# EAGLE design nanoCUL_v3.4 (EAGLE 6.6.0)

## Sheet 1 of 3
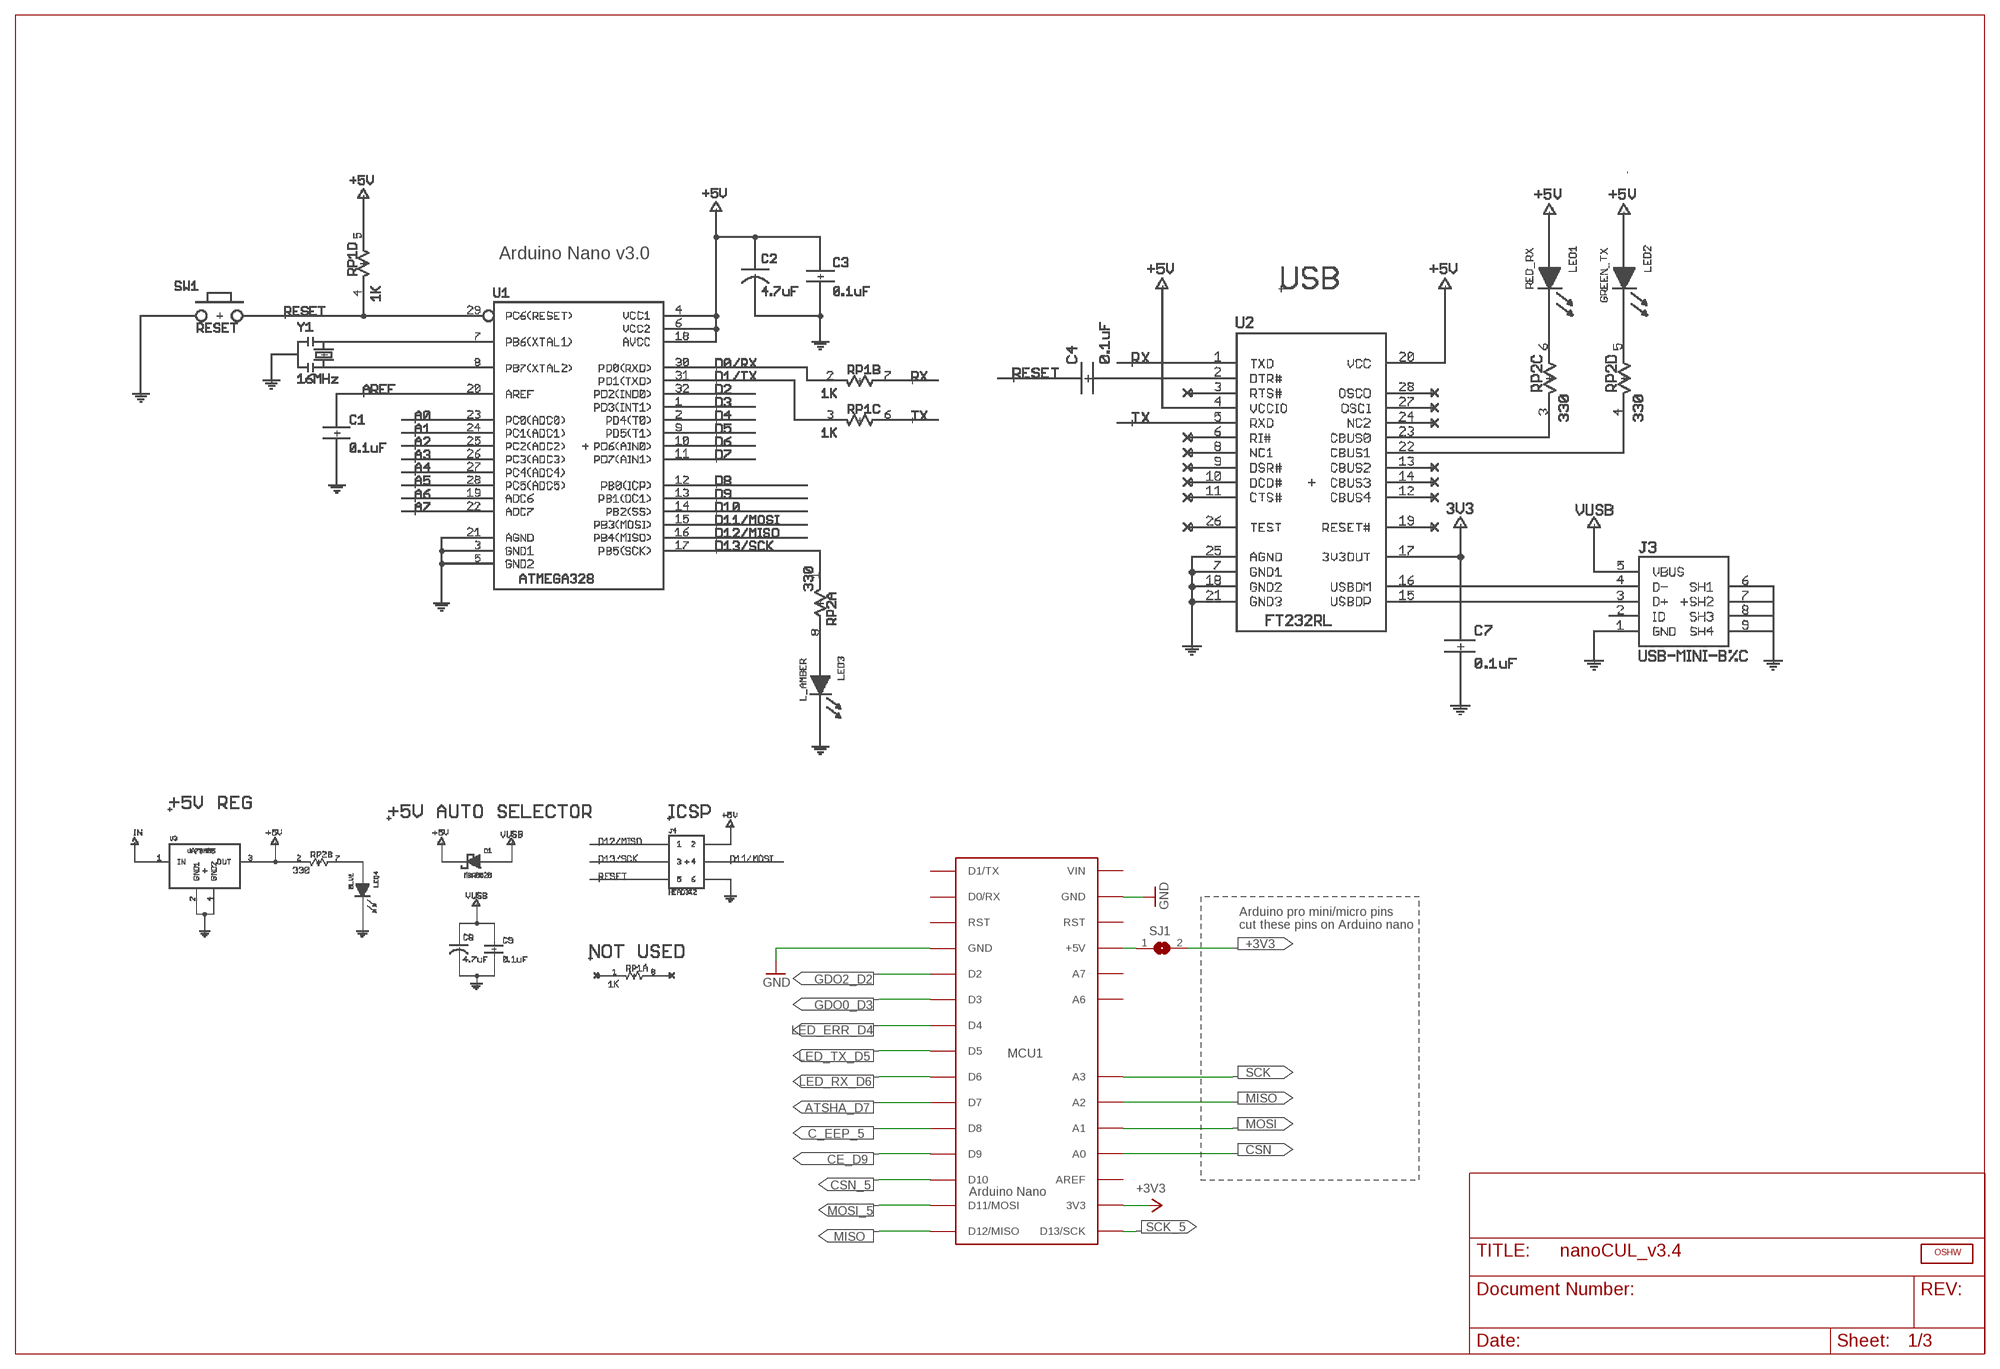
[diagram p0: schematic, sheet 1]

### Parts
LOGO1  LOGO_OSHWX0070  [OSHW_6X70]
MCU1  ARDUINO_NANO_NO_A4-A5  [ARDUINO_NANO_NO_A4-A5]
SJ1  SJ  [SJ]

### Nets
+3V3: MCU1.3V3 SJ1.2 ; also sheet 2,3
+5V: MCU1.+5V SJ1.1
ATSHA_D7: MCU1.D7 ; also sheet 2,3
C_EEP_5: MCU1.D8 ; also sheet 2,3
CE_D9: MCU1.D9 ; also sheet 2,3
CSN: MCU1.A0 ; also sheet 2,3
CSN_5: MCU1.D10 ; also sheet 3
GDO0_D3: MCU1.D3 ; also sheet 2,3
GDO2_D2: MCU1.D2 ; also sheet 2,3
GND: MCU1.GND@0(GND) MCU1.GND@1(GND) ; also sheet 2,3
LED_ERR_D4: MCU1.D4 ; also sheet 2,3
LED_RX_D6: MCU1.D6 ; also sheet 2,3
LED_TX_D5: MCU1.D5 ; also sheet 2,3
MISO: MCU1.A2 MCU1.D12(D12/MISO) ; also sheet 2,3
MOSI: MCU1.A1 ; also sheet 2,3
MOSI_5: MCU1.D11(D11/MOSI) ; also sheet 3
SCK: MCU1.A3 ; also sheet 2,3
SCK_5: MCU1.D13(D13/SCK) ; also sheet 3
Unconnected: MCU1.A6 MCU1.A7 MCU1.AREF MCU1.D0/RX MCU1.D1/TX MCU1.RESET@0(RST) MCU1.RESET@1(RST) MCU1.VIN

### Notes on the sheet
- Arduino Nano v3.0
- Arduino pro mini/micro pins
- cut these pins on Arduino nano

## Sheet 2 of 3
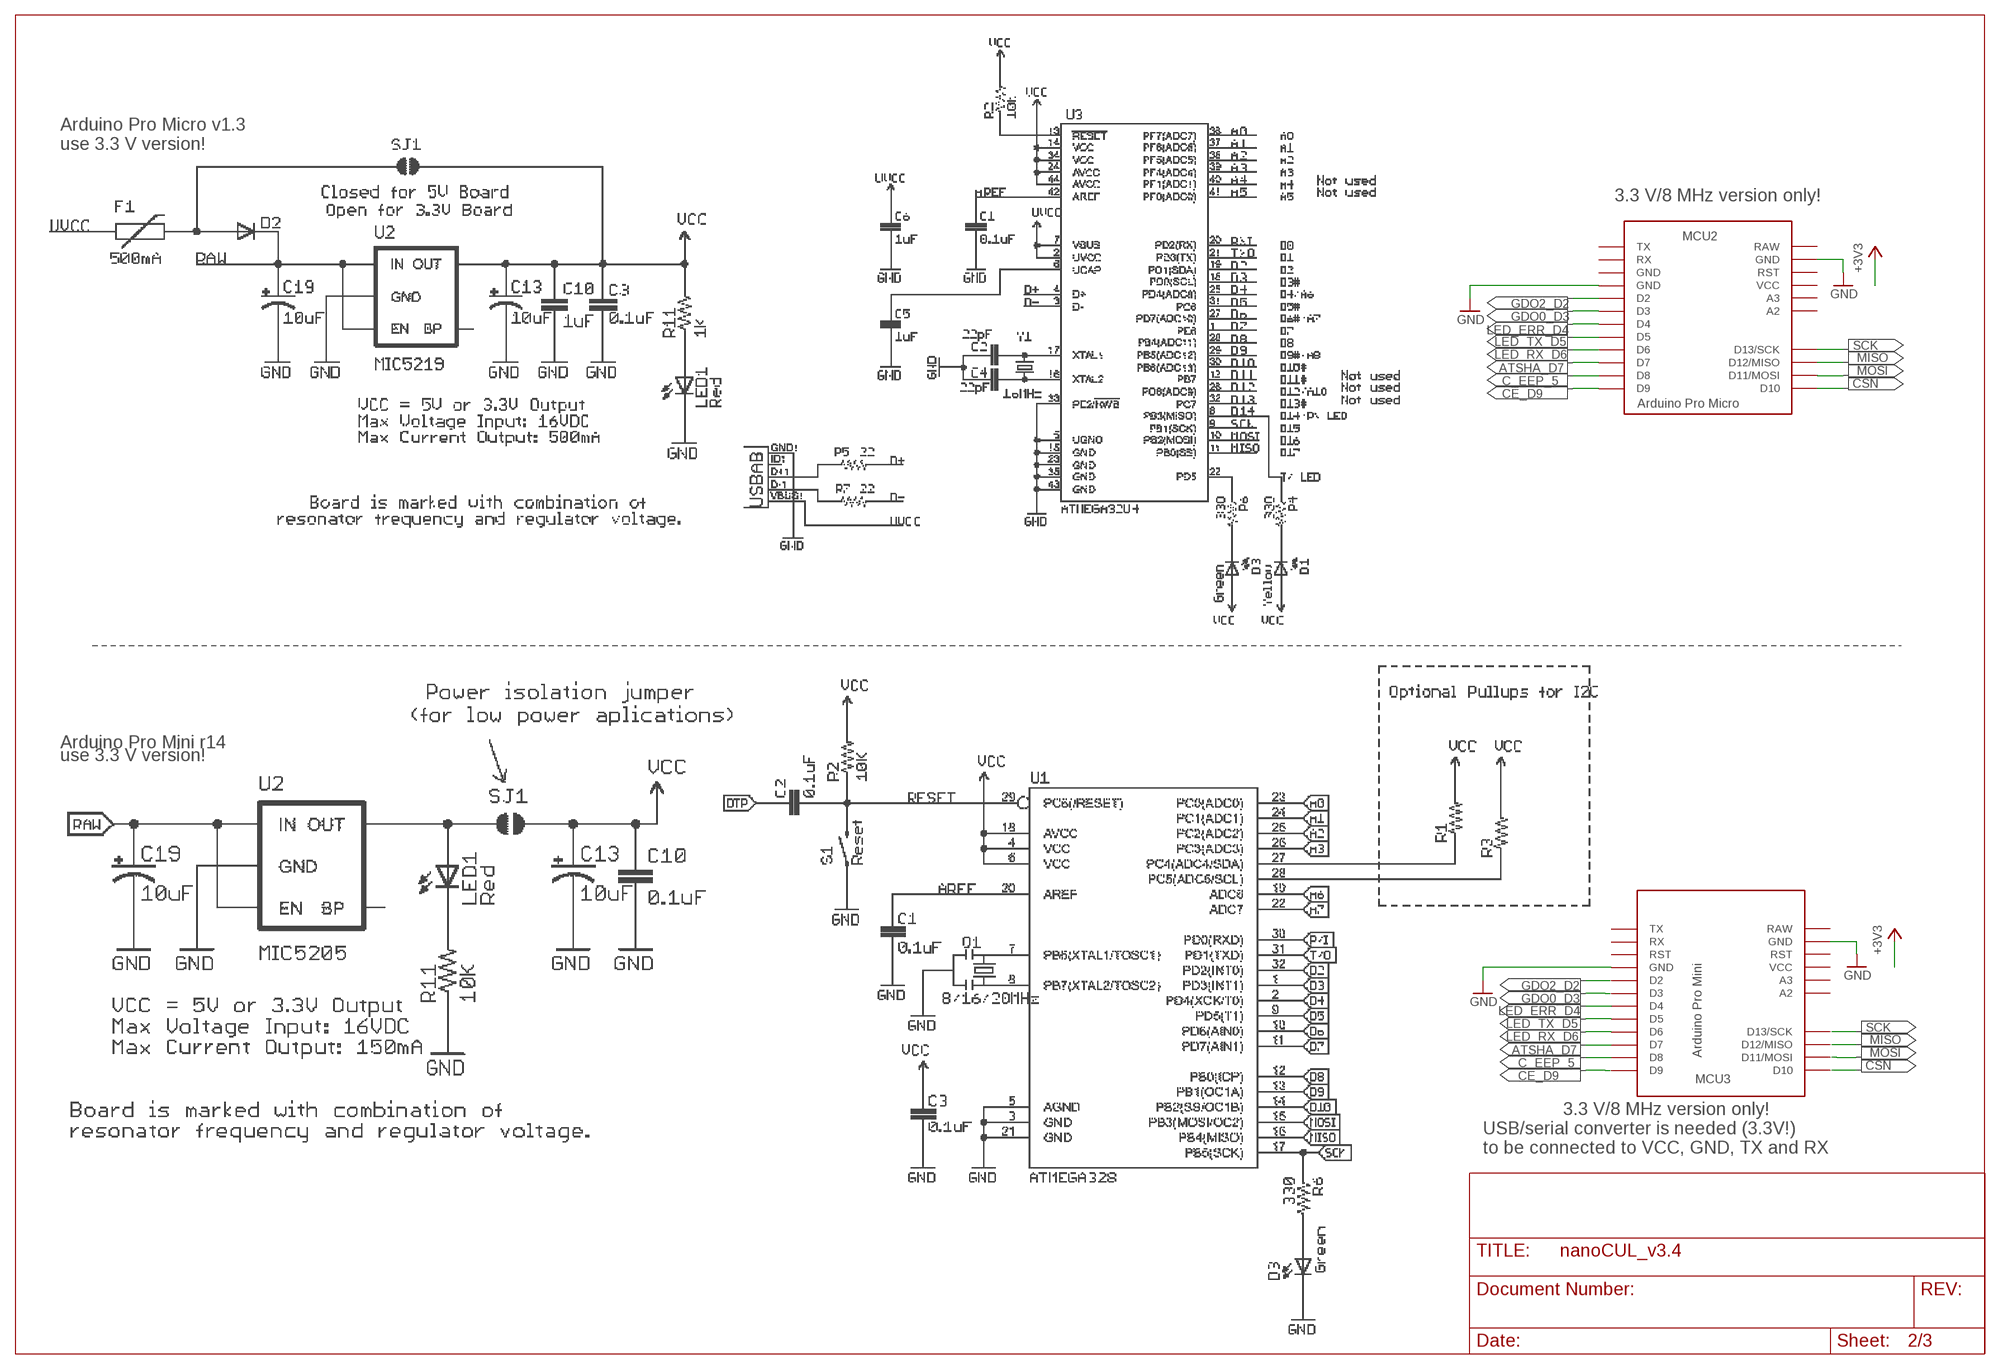
[diagram p1: schematic, sheet 2]

### Parts
MCU2  ARDUINO_PRO_MICRO_NO_A0-A1  [ARDUINO_PRO_MICRO_NO_A0-A1]
MCU3  ARDUINO_PRO_MINI_NO_A0-A1  [ARDUINO_PRO_MINI_NO_A0-A1]

### Nets
ATSHA_D7: MCU2.D7 MCU3.D7 ; also sheet 1,3
C_EEP_5: MCU2.D8 MCU3.D8 ; also sheet 1,3
CE_D9: MCU2.D9 MCU3.D9 ; also sheet 1,3
CSN: MCU2.D10 MCU3.D10 ; also sheet 1,3
GDO0_D3: MCU2.D3 MCU3.D3 ; also sheet 1,3
GDO2_D2: MCU2.D2 MCU3.D2 ; also sheet 1,3
GND: MCU2.GND@1(GND) MCU2.GND@2(GND) MCU3.GND@0(GND) MCU3.GND@1(GND) ; also sheet 1,3
LED_ERR_D4: MCU2.D4 MCU3.D4 ; also sheet 1,3
LED_RX_D6: MCU2.D6 MCU3.D6 ; also sheet 1,3
LED_TX_D5: MCU2.D5 MCU3.D5 ; also sheet 1,3
MISO: MCU2.D12/MISO MCU3.D12/MISO ; also sheet 1,3
MOSI: MCU2.D11/MOSI MCU3.D11/MOSI ; also sheet 1,3
SCK: MCU2.D13/SCK MCU3.D13/SCK ; also sheet 1,3
Unconnected: MCU2.A2 MCU2.A3 MCU2.GND@0(GND) MCU2.RAW MCU2.RST MCU2.RX MCU2.TX MCU2.VCC MCU3.A2 MCU3.A3 MCU3.RAW MCU3.RST@0(RST) MCU3.RST@1(RST) MCU3.RX@0(RX) MCU3.TX@0(TX) MCU3.VCC@0(VCC)

### Notes on the sheet
- Arduino Pro Micro v1.3
- use 3.3 V version!
- 3.3 V/8 MHz version only!
- Arduino Pro Mini r14
- use 3.3 V version!
- 3.3 V/8 MHz version only!
- USB/serial converter is needed (3.3V!)
- to be connected to VCC, GND, TX and RX

## Sheet 3 of 3
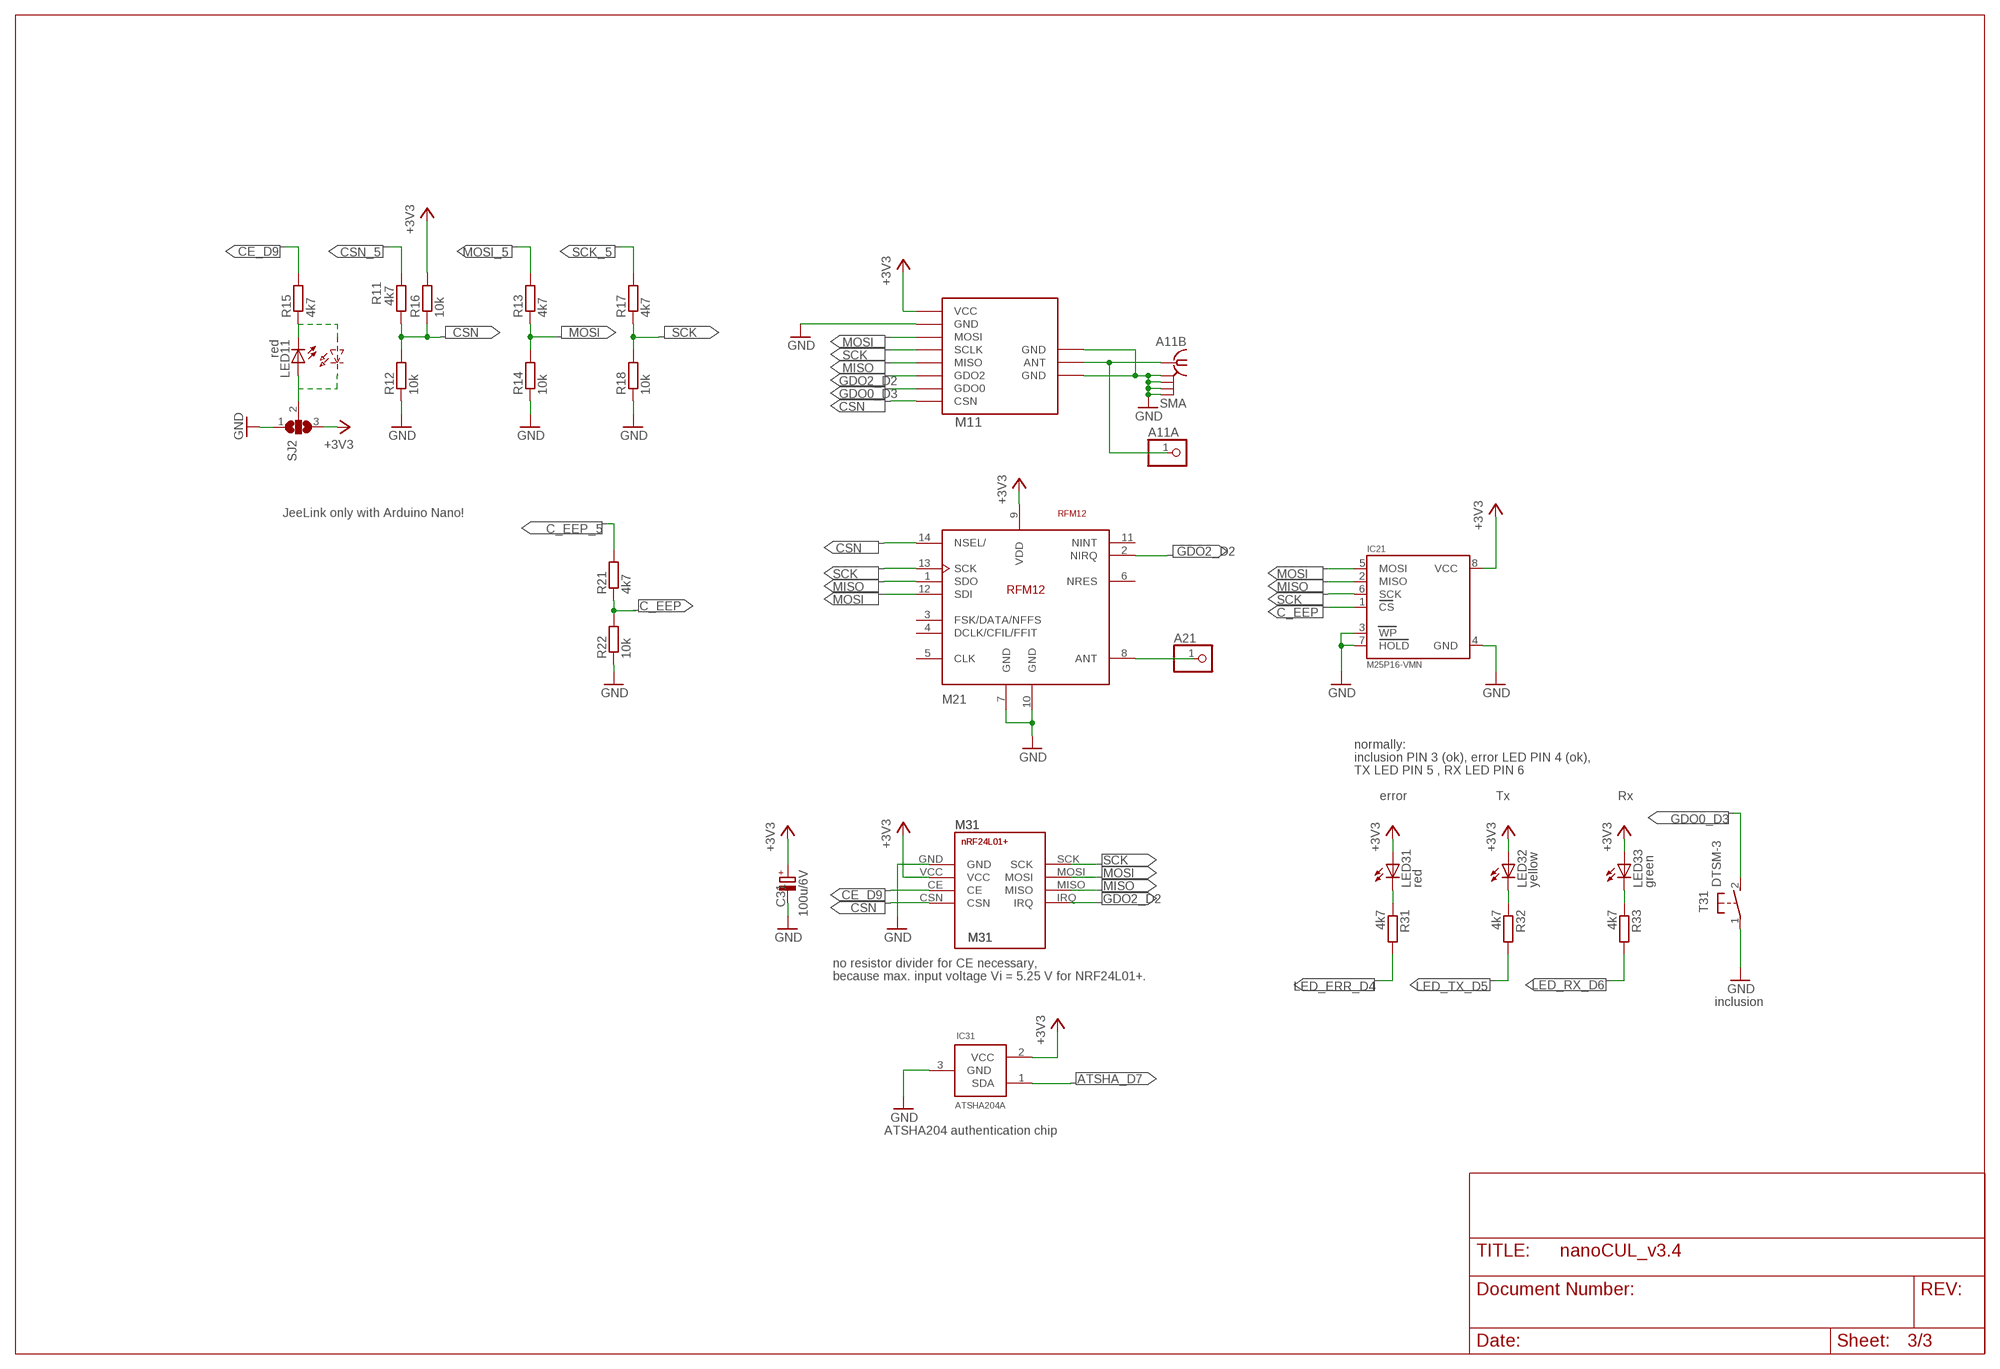
[diagram p2: schematic, sheet 3]

### Parts
A11A  PINHD-1X1  [1X01]
A11B  SMA  [SMA]
A21  PINHD-1X1  [1X01]
C31  100u/6V  CPOL-EUCT3528  [CT3528]
IC21  M25P16-VMN  EEPROM_SPI_AT25040A  [SOIC8]
IC31  ATSHA204A  [SOT23]
LED11  red  LEDCHIPLED_1206  [CHIPLED_1206]
LED31  red  LEDCHIPLED_1206  [CHIPLED_1206]
LED32  yellow  LEDCHIPLED_1206  [CHIPLED_1206]
LED33  green  LEDCHIPLED_1206  [CHIPLED_1206]
M11  CC1101_MODULE1DIL_BIG  [CC1101_MODULE1_DIL-2]
M21  RFM12  RFM12SMALL  [RFM12_SMALL]
M31  NRF24L01+SMD  [NRF24L01+SMD]
R11  4k7  R-EU_R0805  [R0805]
R12  10k  R-EU_R0805  [R0805]
R13  4k7  R-EU_R0805  [R0805]
R14  10k  R-EU_R0805  [R0805]
R15  4k7  R-EU_R0805  [R0805]
R16  10k  R-EU_R0805  [R0805]
R17  4k7  R-EU_R0805  [R0805]
R18  10k  R-EU_R0805  [R0805]
R21  4k7  R-EU_R0805  [R0805]
R22  10k  R-EU_R0805  [R0805]
R31  4k7  R-EU_R0805  [R0805]
R32  4k7  R-EU_R0805  [R0805]
R33  4k7  R-EU_R0805  [R0805]
SJ2  SJ2W  [SJ_2]
T31  DTSM-3  [DTSM-3]

### Nets
+3V3: C31.+ IC21.8(VCC) IC31.2(VCC) LED31.A LED32.A LED33.A M11.1(VCC) M21.9(VDD) M31.VCC R16.2 SJ2.3 ; also sheet 1,2
ANT1: A11A.1 A11B.1 M11.10(ANT)
ANT2: A21.1 M21.8(ANT)
ATSHA_D7: IC31.1(SDA) ; also sheet 1,2
C_EEP: IC21.1(CS) R21.1 R22.2
C_EEP_5: R21.2 ; also sheet 1,2
CE_D9: M31.CE R15.2 ; also sheet 1,2
CSN: M11.8(CSN) M21.14(NSEL/) M31.CSN R11.1 R12.2 R16.1 ; also sheet 1,2
CSN_5: R11.2 ; also sheet 1
GDO0_D3: M11.7(GDO0) T31.2 ; also sheet 1,2
GDO2_D2: M11.6(GDO2) M21.2(NIRQ) M31.IRQ ; also sheet 1,2
GND: A11B.GND@1 A11B.GND@2 A11B.GND@3 A11B.GND@4 C31.- IC21.3(WP) IC21.4(GND) IC21.7(HOLD) IC31.3(GND) M11.2(GND) M11.9(GND) M11.11(GND) M21.7(GND) M21.10(GND) M31.GND R12.1 R14.1 R18.1 R22.1 SJ2.1 T31.1 ; also sheet 1,2
LED_ERR_D4: R31.2 ; also sheet 1,2
LED_RX_D6: R33.2 ; also sheet 1,2
LED_TX_D5: R32.2 ; also sheet 1,2
MISO: IC21.2(MISO) M11.5(MISO) M21.1(SDO) M31.MISO ; also sheet 1,2
MOSI: IC21.5(MOSI) M11.3(MOSI) M21.12(SDI) M31.MOSI R13.1 R14.2 ; also sheet 1,2
MOSI_5: R13.2 ; also sheet 1
N$1: LED31.C R31.1
N$2: LED11.C R15.1
N$3: LED32.C R32.1
N$4: LED33.C R33.1
N$6: LED11.A SJ2.2
SCK: IC21.6(SCK) M11.4(SCLK) M21.13(SCK) M31.SCK R17.1 R18.2 ; also sheet 1,2
SCK_5: R17.2 ; also sheet 1
Unconnected: M21.3(FSK/DATA/NFFS) M21.4(DCLK/CFIL/FFIT) M21.5(CLK) M21.6(NRES) M21.11(NINT)

### Notes on the sheet
- JeeLink only with Arduino Nano!
- normally:
- inclusion PIN 3 (ok), error LED PIN 4 (ok),
- TX LED PIN 5 , RX LED PIN 6
- error | Tx | Rx
- no resistor divider for CE necessary,
- because max. input voltage Vi = 5.25 V for NRF24L01+.
- inclusion
- ATSHA204 authentication chip

## Library data of the parts
A11A A21 = pinhead:PINHD-1X1: PIN HEADER
A11B = wireless:SMA: SMA 50 Ohm end launch jack receptacle - round contact
C31 = rcl:CPOL-EU: POLARIZED CAPACITOR, European symbol
IC21 = electronics:EEPROM_SPI_AT25040A: AT25010a/40a EEPROM SOIC8 AT25010a, 1K (128 x 8 bit) - Digikey: AT25010AN-10SU2.7-ND AT25040a, 4K (256 x 8 bit) - Digikey: AT25040AN-10SU1.8-ND TSSOP8 AT25010a, 1K (128 x 8 bit) - Digikey: AT25010A-10TU-1.8-ND AT25040a, 4K (256 x 8 bit) - Digikey: AT25040A-10TU-1.8-ND
IC31 = Sensor:ATSHA204A
LED11 LED31-LED33 = led:LED: LED OSRAM: - CHIPLED LG R971, LG N971, LY N971, LG Q971, LY Q971, LO R971, LY R971 LH N974, LH R974 LS Q976, LO Q976, LY Q976 LO Q996 - Hyper CHIPLED LW Q18S LB Q993, LB Q99A, LB R99A - SideLED LS A670, LO A670, LY A670, LG A670, LP A670 LB A673, LV A673, LT A673, LW A673 LH A674 LY A675 LS A676, LA A676, LO A676, LY A676, LW A676 LS A679, LY A679, LG A679 - Hyper Micro SIDELED® LS Y876, LA Y876, LO Y876, LY Y876 LT Y87S - SmartLED LW L88C, LW L88S LB L89C, LB L89S, LG L890 LS L89K, LO L89K, LY L89K LS L896, LA L896, LO L896, LY L896 - TOPLED LS T670, LO T670, LY T670, LG T670, LP T670 LSG T670, LSP T670, LSY T670, LOP T670, LYG T670 LG T671, LOG T671, LSG T671 LB T673, LV T673, LT T673, LW T673 LH T674 LS T676, LA T676, LO T676, LY T676, LB T676, LH T676, LSB T676, LW T676 LB T67C, LV T67C, LT T67C, LS T67K, LO T67K, LY T67K, LW E67C LS E67B, LA E67B, LO E67B, LY E67B, LB E67C, LV E67C, LT E67C LW T67C LS T679, LY T679, LG T679 LS T770, LO T770, LY T770, LG T770, LP T770 LB T773, LV T773, LT T773, LW T773 LH T774 LS E675, LA E675, LY E675, LS T675 LS T776, LA T776, LO T776, LY T776, LB T776 LHGB T686 LT T68C, LB T68C - Hyper Mini TOPLED® LB M676 - Mini TOPLED Santana® LG M470 LS M47K, LO M47K, LY M47K Source: http://www.osram.convergy.de LUXEON: - LUMILED® LXK2-PW12-R00, LXK2-PW12-S00, LXK2-PW14-U00, LXK2-PW14-V00 LXK2-PM12-R00, LXK2-PM12-S00, LXK2-PM14-U00 LXK2-PE12-Q00, LXK2-PE12-R00, LXK2-PE12-S00, LXK2-PE14-T00, LXK2-PE14-U00 LXK2-PB12-K00, LXK2-PB12-L00, LXK2-PB12-M00, LXK2-PB14-N00, LXK2-PB14-P00, LXK2-PB14-Q00 LXK2-PR12-L00, LXK2-PR12-M00, LXK2-PR14-Q00, LXK2-PR14-R00 LXK2-PD12-Q00, LXK2-PD12-R00, LXK2-PD12-S00 LXK2-PH12-R00, LXK2-PH12-S00 LXK2-PL12-P00, LXK2-PL12-Q00, LXK2-PL12-R00 Source: www.luxeon.com KINGBRIGHT: KA-3528ASYC Source: www.kingbright.com
LOGO1 = mechanics:LOGO_OSHW: Open-Source-Hardware Logo
M11 = wireless:CC1101_MODULE1: CC1101 wireless module for 433/868 MHz (sold from Aliexpress). DIL version for mounting with pin header (and SMD soldering) and SMD only variant available.
M21 = wireless:RFM12: RFM12B Universal ISM Band FSK Transceiver
M31 = wireless:NRF24L01+: nRF24L01+ Transceiver Module
MCU1 = arduino:ARDUINO_NANO_NO_A4-A5: Modifiziert für nanoCUL V3 2Pins enfernt für CC1101
MCU2 = arduino:ARDUINO_PRO_MICRO_NO_A0-A1: Modifiziert für nanoCUL V3 2Pins enfernt für CC1101
MCU3 = arduino:ARDUINO_PRO_MINI_NO_A0-A1: Modifiziert für nanoCUL V3 2Pins enfernt für CC1101
R11-R18 R21 R22 R31-R33 = rcl:R-EU_: RESISTOR, European symbol
SJ1 = jumper:SJ: SMD solder JUMPER
SJ2 = jumper:SJ2W: SMD solder JUMPER
T31 = mechanics:DTSM-3: Diptronics SMD button 6x3.5 mm

## Board
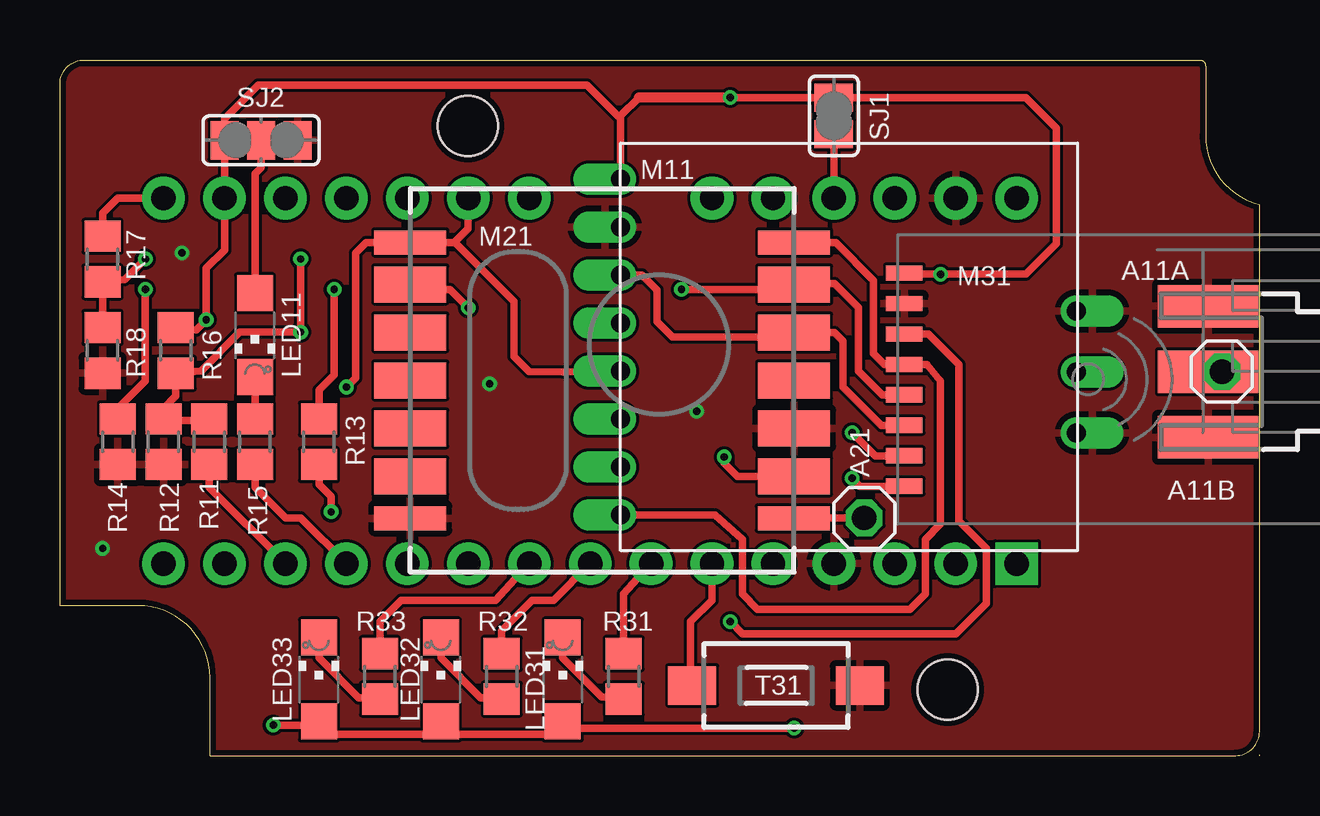
[diagram p3: board, top side]
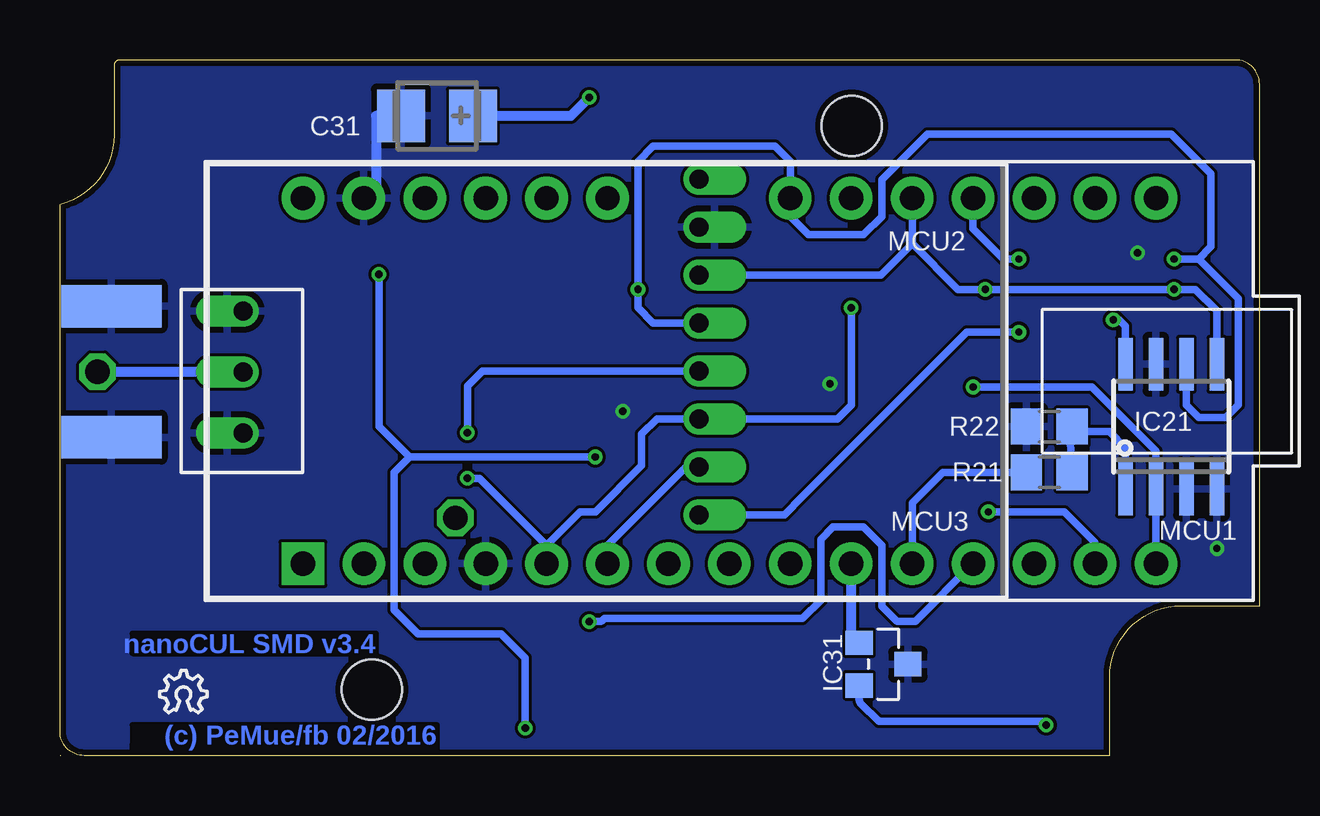
[diagram p4: board, bottom side, seen from below]

Size 50 x 29 mm. Coordinates in mm from the lower left corner, seen from the top.
Outline: 47.75,25.88 47.75,28.75 arc90 47.5,29 1,29 arc90 0,28 0,6.25 3.25,6.25 arc-90 6.25,3.25 6.25,0 49,0 arc90 50,1 50,22.98
Outline: 47.75,25.88 47.75,25.75
Outline: 50,0 arc-90 50,0
Outline: 47.75,25.88 arc76 50,22.98
Copper layers (1*16): Top 0.035mm / dielectric 1.5mm / Bottom 0.035mm
Design rules "dirtypcbs_v1.0": minimum track width 5mil, minimum drill 12mil, track to track 5mil, track to pad 5mil, pad to pad 5mil, via to via 5mil, smd to smd 0mil, copper to edge 10mil, drill to drill 10mil, minimum pad ring 10mil, minimum via ring 6mil, stop-mask expansion 2mil, vias tented up to drill 25mil, thermal gap 10mil
Holes 2.5 mm at 37,2.75 17,26.25
bRestrict: 4 lines

### Footprints (pad centres in the part's own frame; a part is rotated, then mirrored left to right if it is on the bottom)
1X01 = drill 1.016 octagon: 1 0,0
SMA = smd 4.191 x 1.778: 1 2.115,0; GND@1 2.115,2.733; GND@2 2.115,-2.733 | smd 4.191 x 1.778 bottom: GND@3 2.115,2.733; GND@4 2.115,-2.733
CT3528 = smd 2 x 2.2: + -1.5,0; - 1.5,0
SOIC8 = smd 0.6 x 2.2: 1 -1.905,-2.6; 2 -0.635,-2.6; 3 0.635,-2.6; 4 1.905,-2.6; 5 1.905,2.6; 6 0.635,2.6; 7 -0.635,2.6; 8 -1.905,2.6
SOT23 = smd 1.016 x 1.143: 1 -0.889,-1.016; 2 0.889,-1.016; 3 0,1.016
CHIPLED_1206 = smd 1.5 x 1.5: A 0,-1.75; C 0,1.75
CC1101_MODULE1_DIL-2 = drill 0.8 offset: 1 0,14; 2 0,12; 3 0,10; 4 0,8; 5 0,6; 6 0,4; 7 0,2; 8 0,0; 9 19,8.5; 10 19,5.96; 11 19,3.42
RFM12_SMALL = smd 3 x 1: 1 0.12,13.64; 7 0.12,2.14; 8 16.11,2.14; 14 16.12,13.64 | smd 3 x 1.5: 2 0.12,11.89; 3 0.12,9.89; 4 0.12,7.89; 5 0.12,5.89; 6 0.12,3.89; 9 16.12,3.89; 10 16.12,5.89; 11 16.12,7.89; 12 16.12,9.89; 13 16.12,11.89
NRF24L01+SMD = smd 0.635 x 1.524: CE -1.575,-7.861; CSN -0.305,-7.861; GND -2.845,-7.861; IRQ 4.775,-7.861; MISO 3.505,-7.861; MOSI 2.235,-7.861; SCK 0.965,-7.861; VCC -4.115,-7.861
ARDUINO_NANO_NO_A4-A5 = drill 1.016 pad 1.778: 3V3 15.24,-35.56; +5V 15.24,-10.16; A0 15.24,-30.48; A1 15.24,-27.94; A2 15.24,-25.4; A3 15.24,-22.86; A6 15.24,-15.24; A7 15.24,-12.7; AREF 15.24,-33.02; D0/RX 0,-5.08; D2 0,-12.7; D3 0,-15.24; D4 0,-17.78; D5 0,-20.32; D6 0,-22.86; D7 0,-25.4; D8 0,-27.94; D9 0,-30.48; D10 0,-33.02; D11 0,-35.56; D12 0,-38.1; D13 15.24,-38.1; GND@0 0,-10.16; GND@1 15.24,-5.08; RESET@0 0,-7.62; RESET@1 15.24,-7.62; VIN 15.24,-2.54 | drill 1.016 pad 1.778 square: D1/TX 0,-2.54
ARDUINO_PRO_MICRO_NO_A0-A1 = drill 1.016 pad 1.778: A2 16.51,16.51; A3 16.51,19.05; D2 1.27,19.05; D3 1.27,16.51; D4 1.27,13.97; D5 1.27,11.43; D6 1.27,8.89; D7 1.27,6.35; D8 1.27,3.81; D9 1.27,1.27; D10 16.51,1.27; D11/MOSI 16.51,3.81; D12/MISO 16.51,6.35; D13/SCK 16.51,8.89; GND@0 1.27,24.13; GND@1 1.27,21.59; GND@2 16.51,26.67; RAW 16.51,29.21; RST 16.51,24.13; RX 1.27,26.67; VCC 16.51,21.59 | drill 1.016 pad 1.778 square: TX 1.27,29.21
ARDUINO_PRO_MINI_NO_A0-A1 = drill 1.016 pad 1.778: A2 16.51,16.51; A3 16.51,19.05; D2 1.27,19.05; D3 1.27,16.51; D4 1.27,13.97; D5 1.27,11.43; D6 1.27,8.89; D7 1.27,6.35; D8 1.27,3.81; D9 1.27,1.27; D10 16.51,1.27; D11/MOSI 16.51,3.81; D12/MISO 16.51,6.35; D13/SCK 16.51,8.89; GND@0 1.27,21.59; GND@1 16.51,26.67; RAW 16.51,29.21; RST@0 1.27,24.13; RST@1 16.51,24.13; RX@0 1.27,26.67; VCC@0 16.51,21.59 | drill 1.016 pad 1.778 square: TX@0 1.27,29.21
R0805 = smd 1.3 x 1.5: 1 -0.95,0; 2 0.95,0
SJ = smd 1.168 x 1.6: 1 -0.762,0; 2 0.762,0
SJ_2 = smd 1.168 x 1.6: 1 -1.524,0; 2 0,0; 3 1.524,0
DTSM-3 = smd 2 x 1.6: 1 -3.494,0; 2 3.494,0

### Placement (x,y rotation side)
A11A  48.44,16 0 top
A11B  49.98,16 180 top
A21  33.53,9.91 0 top
C31  34.29,26.67 180 bottom
IC21  3.68,13.72 0 bottom
IC31  15.67,3.81 270 bottom
LED11  8.13,17.53 180 top
LED31  20.95,3.17 0 top
LED32  15.88,3.17 0 top
LED33  10.79,3.17 0 top
LOGO1  45.85,1.78 0 bottom
M11  23.37,10.03 0 top
M21  14.48,7.75 0 top
M31  43.05,16 270 top
MCU1  42.42,8 90 bottom
MCU2  10.67,6.73 90 bottom
MCU3  10.67,6.73 90 bottom
R11  6.22,13.08 270 top
R12  4.32,13.08 90 top
R13  10.79,13.08 270 top
R14  2.41,13.08 90 top
R15  8.13,13.08 270 top
R16  4.83,16.89 90 top
R17  1.78,20.7 90 top
R18  1.78,16.89 90 top
R21  8.76,11.81 180 bottom
R22  8.76,13.72 0 bottom
R31  23.5,3.3 90 top
R32  18.41,3.3 90 top
R33  13.34,3.3 90 top
SJ1  32.26,26.67 90 top
SJ2  8.38,25.65 180 top
T31  29.84,2.92 180 top

### Tracks (layer width: path | path; a pad name or v marks a point on that pad's centre or on a via)
+3V3  (via drill 0.3)
  Top 0.305: R16.2 5.68,17.74 v6.1,18.16 6.1,20.32 6.86,21.08 MCU1.3V3 SJ2.3 6.86,26.54 8.26,27.94 21.97,27.94 23.37,26.54 | 23.37,26.54 23.37,26.67 24.13,27.43 | M31.VCC 35.19,20.07 v36.7,20.07 40.26,20.07 41.53,21.34 41.53,26.16 40.26,27.43 SJ1.2 v27.94,27.43 | M21.9 28.24,11.64 27.69,12.19 v27.69,12.45 | 15.88,0.89 10.79,0.89 LED33.A 10.64,1.27 v8.89,1.27 | 15.88,0.89 LED32.A | 15.88,0.89 20.95,0.89 LED31.A 20.98,1.4 20.95,1.4 20.95,1.14 v30.61,1.14 | 23.37,26.54 M11.1
  Top 0.406: v27.94,27.43 24.13,27.43
  Bottom 0.305: 5.59,16.26 IC21.8 5.59,17.91 5.84,18.16 v6.1,18.16 | v36.7,20.07 36.7,13.72 35.43,12.45 | 35.43,12.45 v27.69,12.45 | v30.61,1.14 30.61,4.08 31.61,5.08 35.07,5.08 36.07,6.08 36.07,11.81 35.43,12.45 | IC31.2 16.69,2.34 arc-45 16.61,2.16 LED32.A 9.04,1.43 v8.89,1.27
  Bottom 0.406: C31.+ 28.7,26.67 v27.94,27.43
+5V
  Top 0.305: SJ1.1 MCU1.+5V
ANT1
  Top 0.406: A11B.1 A11A.1
  Bottom 0.406: M11.10 47.62,15.99 A11A.1 A11B.1
ANT2
  Top 0.305: M21.8 30.97,9.89 30.99,9.91 A21.1
ATSHA_D7
  Bottom 0.406: IC31.1 16.76,4.7 arc90 17.02,4.95 MCU1.D7
C_EEP
  Bottom 0.305: R22.2 8.13,13.72 7.91,13.5 | R21.1 7.91,13.5 | IC21.1 5.59,12.83 6.26,13.5 7.91,13.5
C_EEP_5
  Bottom 0.305: 9.4,11.81 R21.2 13.21,11.81 14.48,10.54 MCU3.D8
CE_D9  (via drill 0.3)
  Top 0.305: R15.2 8.13,11.18 9.4,9.91 10.03,9.91 MCU3.D9 | M31.CE 36.2,17.58 37.47,16.31 37.47,9.78 38.61,8.64 38.61,6.35 37.34,5.08 28.45,5.08 v27.94,5.59
  Bottom 0.305: MCU3.D9 14.35,5.59 15.01,5.59 arc45 15.19,5.66 15.75,6.22 15.75,8.76 16.51,9.53 17.78,9.53 18.29,9.02 18.29,6.48 19.05,5.71 27.3,5.71 27.36,5.66 arc45 27.54,5.59 v27.94,5.59
CSN  (via drill 0.3)
  Top 0.305: R11.1 6.22,13.97 4.32,13.97 R12.2 4.32,14.48 4.83,14.99 R16.1 5.88,16.04 7.49,17.65 v10.03,17.65 v10.03,20.7 | M21.14 32.33,21.39 33.91,19.81 33.91,16.76 34.37,16.31 M31.CSN 36.14,16.31 36.7,15.62 36.7,9.65 36.07,9.02 36.07,6.73 35.43,6.1 29.08,6.1 28.45,6.73 28.45,9.02 27.3,10.03 M11.8
  Bottom 0.305: v10.03,17.65 12.19,17.65 19.05,10.79 19.81,10.03 M11.8 | MCU3.D10 11.94,21.97 10.67,20.7 v10.03,20.7
CSN_5
  Top 0.305: MCU1.D10 6.22,11.18 R11.2
GDO0_D3
  Top 0.305: T31.2 26.29,2.98 26.29,5.59 27.18,6.48 MCU3.D3
  Bottom 0.305: M11.7 23.91,12.03 27.18,8.76 MCU3.D3
GDO2_D2  (via drill 0.3)
  Top 0.305: M21.2 14.8,19.43 16.26,19.43 v17.02,18.67 | M31.IRQ 33.35,11.23 v33.02,11.56
  Bottom 0.305: v17.02,18.67 17.02,14.61 17.59,14.03 M11.6 25.12,14.03 25.76,13.4 25.76,12.09 27.69,10.16 28.32,10.16 29.72,8.76 | v33.02,11.56 32.51,11.56 29.72,8.76 | 29.72,8.76 MCU3.D2
GND  (via drill 0.3, 0.3 pad 0.61)
  Bottom 0.406: C31.- 36.83,26.67 36.83,23.75 MCU3.GND@1
  other vias: 26.54,14.35 1.78,8.64 17.91,15.49 5.08,20.95
  pour Bottom: 0,0 0,29.08 49.85,28.96 49.85,0
  pour Top: 0,0 0,29.08 49.85,28.96 49.85,0
LED_ERR_D4
  Top 0.305: R31.2 23.5,6.73 MCU1.D4
LED_RX_D6
  Top 0.305: R33.2 13.34,5.59 14.22,6.48 18.16,6.48 MCU2.D6
LED_TX_D5
  Top 0.305: R32.2 18.41,5.21 19.68,6.48 20.57,6.48 MCU2.D5
MISO  (via drill 0.3)
  Top 0.305: M11.5 20.97,15.99 19.56,16 18.92,16.64 18.92,18.92 16.46,21.39 16.43,21.39 | 16.43,21.39 M21.1 12.75,21.39 12.32,20.95 12.32,15.75 v11.94,15.37 | 16.43,21.39 17.02,21.97 MCU3.D12/MISO | M31.MISO 33.98,12.5 v33.02,13.46
  Bottom 0.305: IC21.2 4.32,11.18 | MCU1.D12 IC21.2 | M11.5 32.38,16.03 33.02,15.4 v33.02,13.46 | v11.94,15.37 6.99,15.37 4.32,12.7 IC21.2
MOSI  (via drill 0.3)
  Top 0.305: R14.2 2.41,14.48 3.56,15.62 v3.56,19.43 | v11.43,19.43 11.43,15.88 10.79,15.24 R13.1 | M31.MOSI 34.24,13.77 32.64,15.37 32.64,17.27 32.27,17.64 M21.12 30.61,17.65 30.41,17.45 25.53,17.45 24.89,18.09 24.89,19.4 24.26,20.03 M11.3
  Bottom 0.305: 14.48,21.34 12.57,19.43 v11.43,19.43 v3.56,19.43 2.67,19.43 1.78,18.54 IC21.5 | 14.48,21.34 15.3,20.51 | 15.3,20.51 15.37,20.45 | 14.48,21.34 MCU3.D11/MOSI | M11.3 15.78,20.03 15.3,20.51
MOSI_5  (via drill 0.3)
  Top 0.305: v11.3,10.16 11.3,10.79 10.79,11.3 R13.2
  Bottom 0.305: MCU1.D11 6.86,8.89 8.13,10.16 v11.3,10.16
N$1
  Top 0.305: LED31.C 20.95,4.06 22.35,2.67 22.57,2.45 R31.1
N$2
  Top 0.305: LED11.C R15.1
N$3
  Top 0.305: LED32.C 15.88,4.06 17.53,2.41 18.35,2.41 R32.1
N$4
  Top 0.305: LED33.C 10.79,4.06 12.45,2.41 13.27,2.41 R33.1
N$6
  Top 0.305: SJ2.2 8.38,24.51 8.13,24.26 LED11.A
SCK  (via drill 0.3)
  Top 0.305: R18.2 R17.1 2.71,19.85 v3.56,20.7 | v25.91,19.43 30.35,19.43 30.56,19.64 M21.13 30.61,19.68 32.27,19.68 33.27,18.68 33.27,16.04 34.27,15.04 M31.SCK
  Bottom 0.305: 2.54,20.7 0.89,19.05 0.89,14.61 1.4,14.1 2.54,14.1 3.05,14.61 IC21.6 | 2.54,20.7 v3.56,20.7 | 2.54,20.7 2.03,21.21 2.03,24.26 3.68,25.91 13.84,25.91 15.75,24 15.75,22.48 16.51,21.72 18.8,21.72 19.56,22.48 MCU3.D13/SCK 19.56,24.77 20.19,25.4 25.27,25.4 25.91,24.77 v25.91,19.43 25.91,18.67 25.27,18.03 M11.4
SCK_5
  Top 0.305: R17.2 1.78,22.61 2.41,23.24 MCU1.D13

### Text on the board
Bottom: nanoCUL SMD v3.4 | (c) PeMue/fb 02/2016
Reference: DS_1551H